# Altium schematic sheet powre.SchDoc
size A4
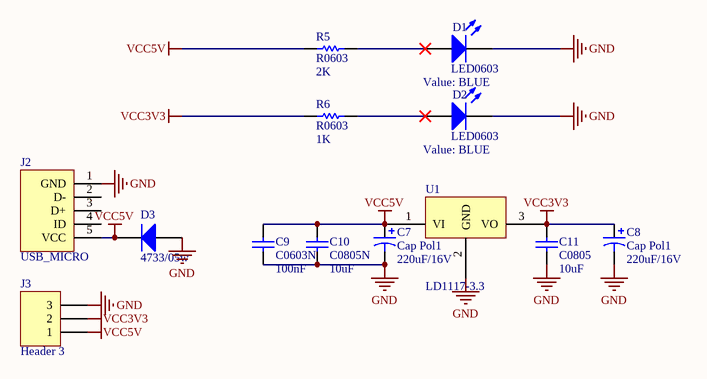
[diagram p0: powre.SchDoc]

## Parts
C7  Cap Pol1  value 220uF/16V  [16V220U]
C8  Cap Pol1  value 220uF/16V  [16V220U]
C9  C0603N  value 100nF  [C0603N]
C10  C0805N  value 10uF  [C0805N]
C11  C0805  value 10uF  [C0805N]
D1  LED0603  value BLUE  [LED0603]
D2  LED0603  value BLUE  [LED0603]
D3  4733/05w  [ZMM5V1]
J2  USB_MICRO  [MICRO USB2]
J3  Header 3  [HDR1X3]
R5  R0603  value 2K  [R0603N]
R6  R0603  value 1K  [R0603N]
U1  LD1117-3.3  [LD1117-3.3V]

## Nets
GND: C7.2 C8.2 C9.1 C10.1 C11.1 D1.2 D2.2 D3.1 J2.1(GND) J3.3 U1.2(GND)
VCC3V3: C8.1 C11.2 J3.2 R6.1 U1.3(VO)
VCC5V: C7.1 C9.2 C10.2 D3.2 J2.5(VCC) J3.1 R5.1 U1.1(VI)
NetD1_1: D1.1 R5.2
NetD2_1: D2.1 R6.2

Not connected (* = marked no-connect by the designer): J2 2(D-) 3(D+) 4(ID)

## Library data of the parts
C7 C8 = Cap Pol1: Polarized Capacitor (Radial); Published: 8-Jun-2000; LatestRevisionDate: 17-Jul-2002; LatestRevisionNote: Re-released for DXP Platform.; PackageReference: RB7.6-15; Publisher: Altium Limited
C9-C11 = Cap Semi: Capacitor (Semiconductor SIM Model)
D1 D2 = LED
D3 = Diode: Default Diode; VALUE: 4733
J2 = USB_powre
J3 = Header 3: Header, 3-Pin; LatestRevisionDate: 17-Jul-2002; LatestRevisionNote: Re-released for DXP Platform.; Publisher: Altium Limited
R5 R6 = Res Semi: Semiconductor Resistor